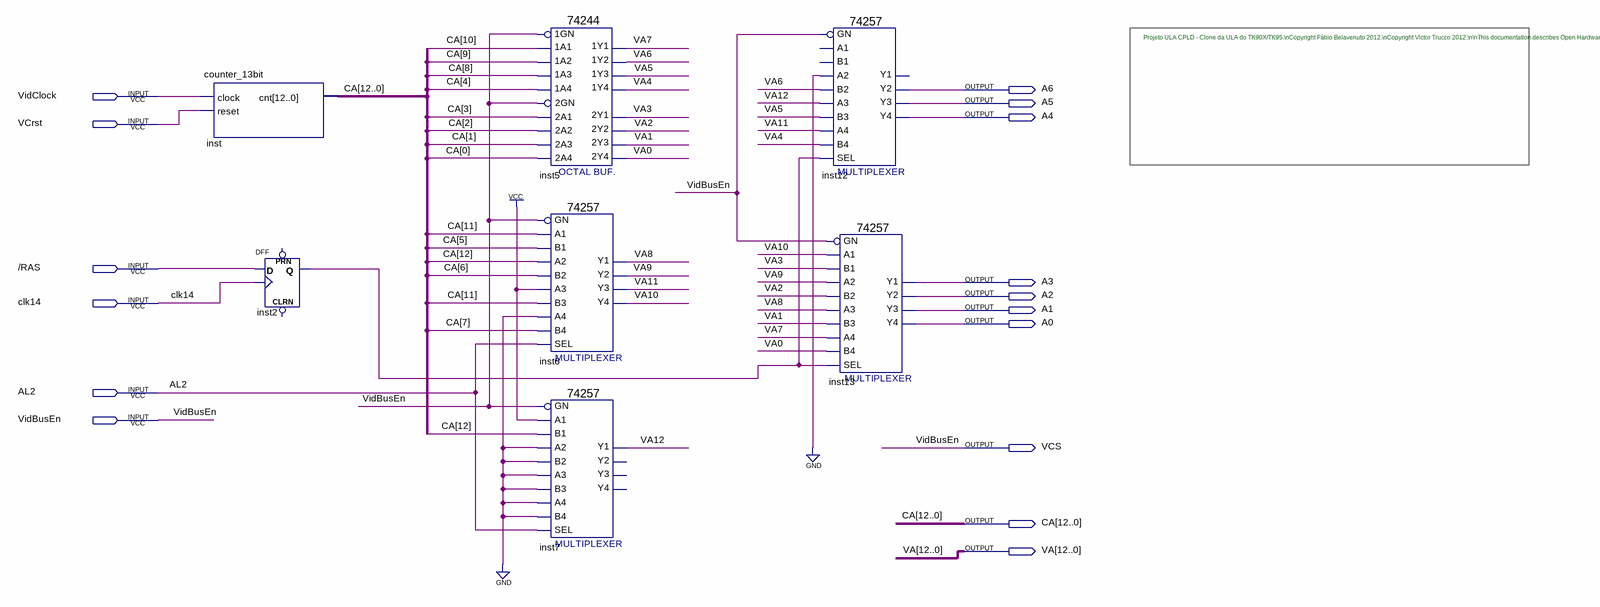
[diagram p0: schematic sheet]
// Quartus schematic DRAM_ADDRESS.bdf as structural Verilog: 7 symbols, 16 pins
module DRAM_ADDRESS (
  input  VidClock,
  input  VCrst,
  input  \/RAS ,
  input  clk14,
  input  AL2,
  input  VidBusEn,
  output A6,
  output A5,
  output A4,
  output A3,
  output A2,
  output A1,
  output A0,
  output VCS,
  output [12:0] CA,
  output [12:0] VA
);

  wire inst2_q;

  counter_13bit inst (.clock(VidClock), .reset(VCrst), .cnt(CA));
  DFF inst2 (.CLK(clk14), .D(\/RAS ), .Q(inst2_q));  // open: CLRN, PRN
  \74244  inst5 (
    .\1A2 (CA[9]), .\1A4 (CA[4]), .\1A1 (CA[10]), .\1A3 (CA[8]), .\1GN (VidBusEn), .\2A3 (CA[1]),
    .\2GN (VidBusEn), .\2A1 (CA[3]), .\2A4 (CA[0]), .\2A2 (CA[2]), .\1Y2 (VA[6]), .\1Y4 (VA[4]),
    .\2Y1 (VA[3]), .\1Y1 (VA[7]), .\2Y3 (VA[1]), .\2Y4 (VA[0]), .\1Y3 (VA[5]), .\2Y2 (VA[2]));
  \74257  inst6 (
    .B1(CA[5]), .A1(CA[11]), .B3(CA[11]), .A2(CA[12]), .B2(CA[6]), .A3(1'b1), .A4(1'b0), .B4(CA[7]),
    .SEL(AL2), .GN(VidBusEn), .Y2(VA[9]), .Y3(VA[11]), .Y4(VA[10]), .Y1(VA[8]));
  \74257  inst7 (
    .B1(CA[12]), .A1(1'b1), .B3(1'b0), .A2(1'b0), .B2(1'b0), .A3(1'b0), .A4(1'b0), .B4(1'b0), .SEL(AL2),
    .GN(VidBusEn), .Y1(VA[12]));  // open: Y2, Y3, Y4
  \74257  inst12 (
    .B3(VA[5]), .A2(1'b0), .B2(VA[6]), .A3(VA[12]), .A4(VA[11]), .B4(VA[4]), .SEL(inst2_q), .GN(VidBusEn),
    .Y2(A6), .Y3(A5), .Y4(A4));  // open: B1, A1, Y1
  \74257  inst13 (
    .B1(VA[3]), .A1(VA[10]), .B3(VA[1]), .A2(VA[9]), .B2(VA[2]), .A3(VA[8]), .A4(VA[7]), .B4(VA[0]),
    .SEL(inst2_q), .GN(VidBusEn), .Y2(A2), .Y3(A1), .Y4(A0), .Y1(A3));

  assign VCS = VidBusEn;

  // Notes on the sheet:
  //   Projeto ULA CPLD - Clone da ULA do TK90X/TK95.\nCopyright Fábio Belavenuto 2012.\nCopyright Victor Trucco 2012.\n\nThis documentation describes Open Hardware and is licensed under the CERN OHL v. 1.1.\nYou may redistribute and modify this documentation under the terms of the\nCERN OHL v.1.1. (http://ohwr.org/cernohl). This documentation is distributed\nWITHOUT ANY EXPRESS OR IMPLIED WARRANTY, INCLUDING OF MERCHANTABILITY,\nSATISFACTORY QUALITY AND FITNESS FOR A PARTICULAR PURPOSE.\nPlease see the CERN OHL v.1.1 for applicable conditions
endmodule
